# EAGLE design ogn_wind_1.4 (EAGLE 9.6.2)
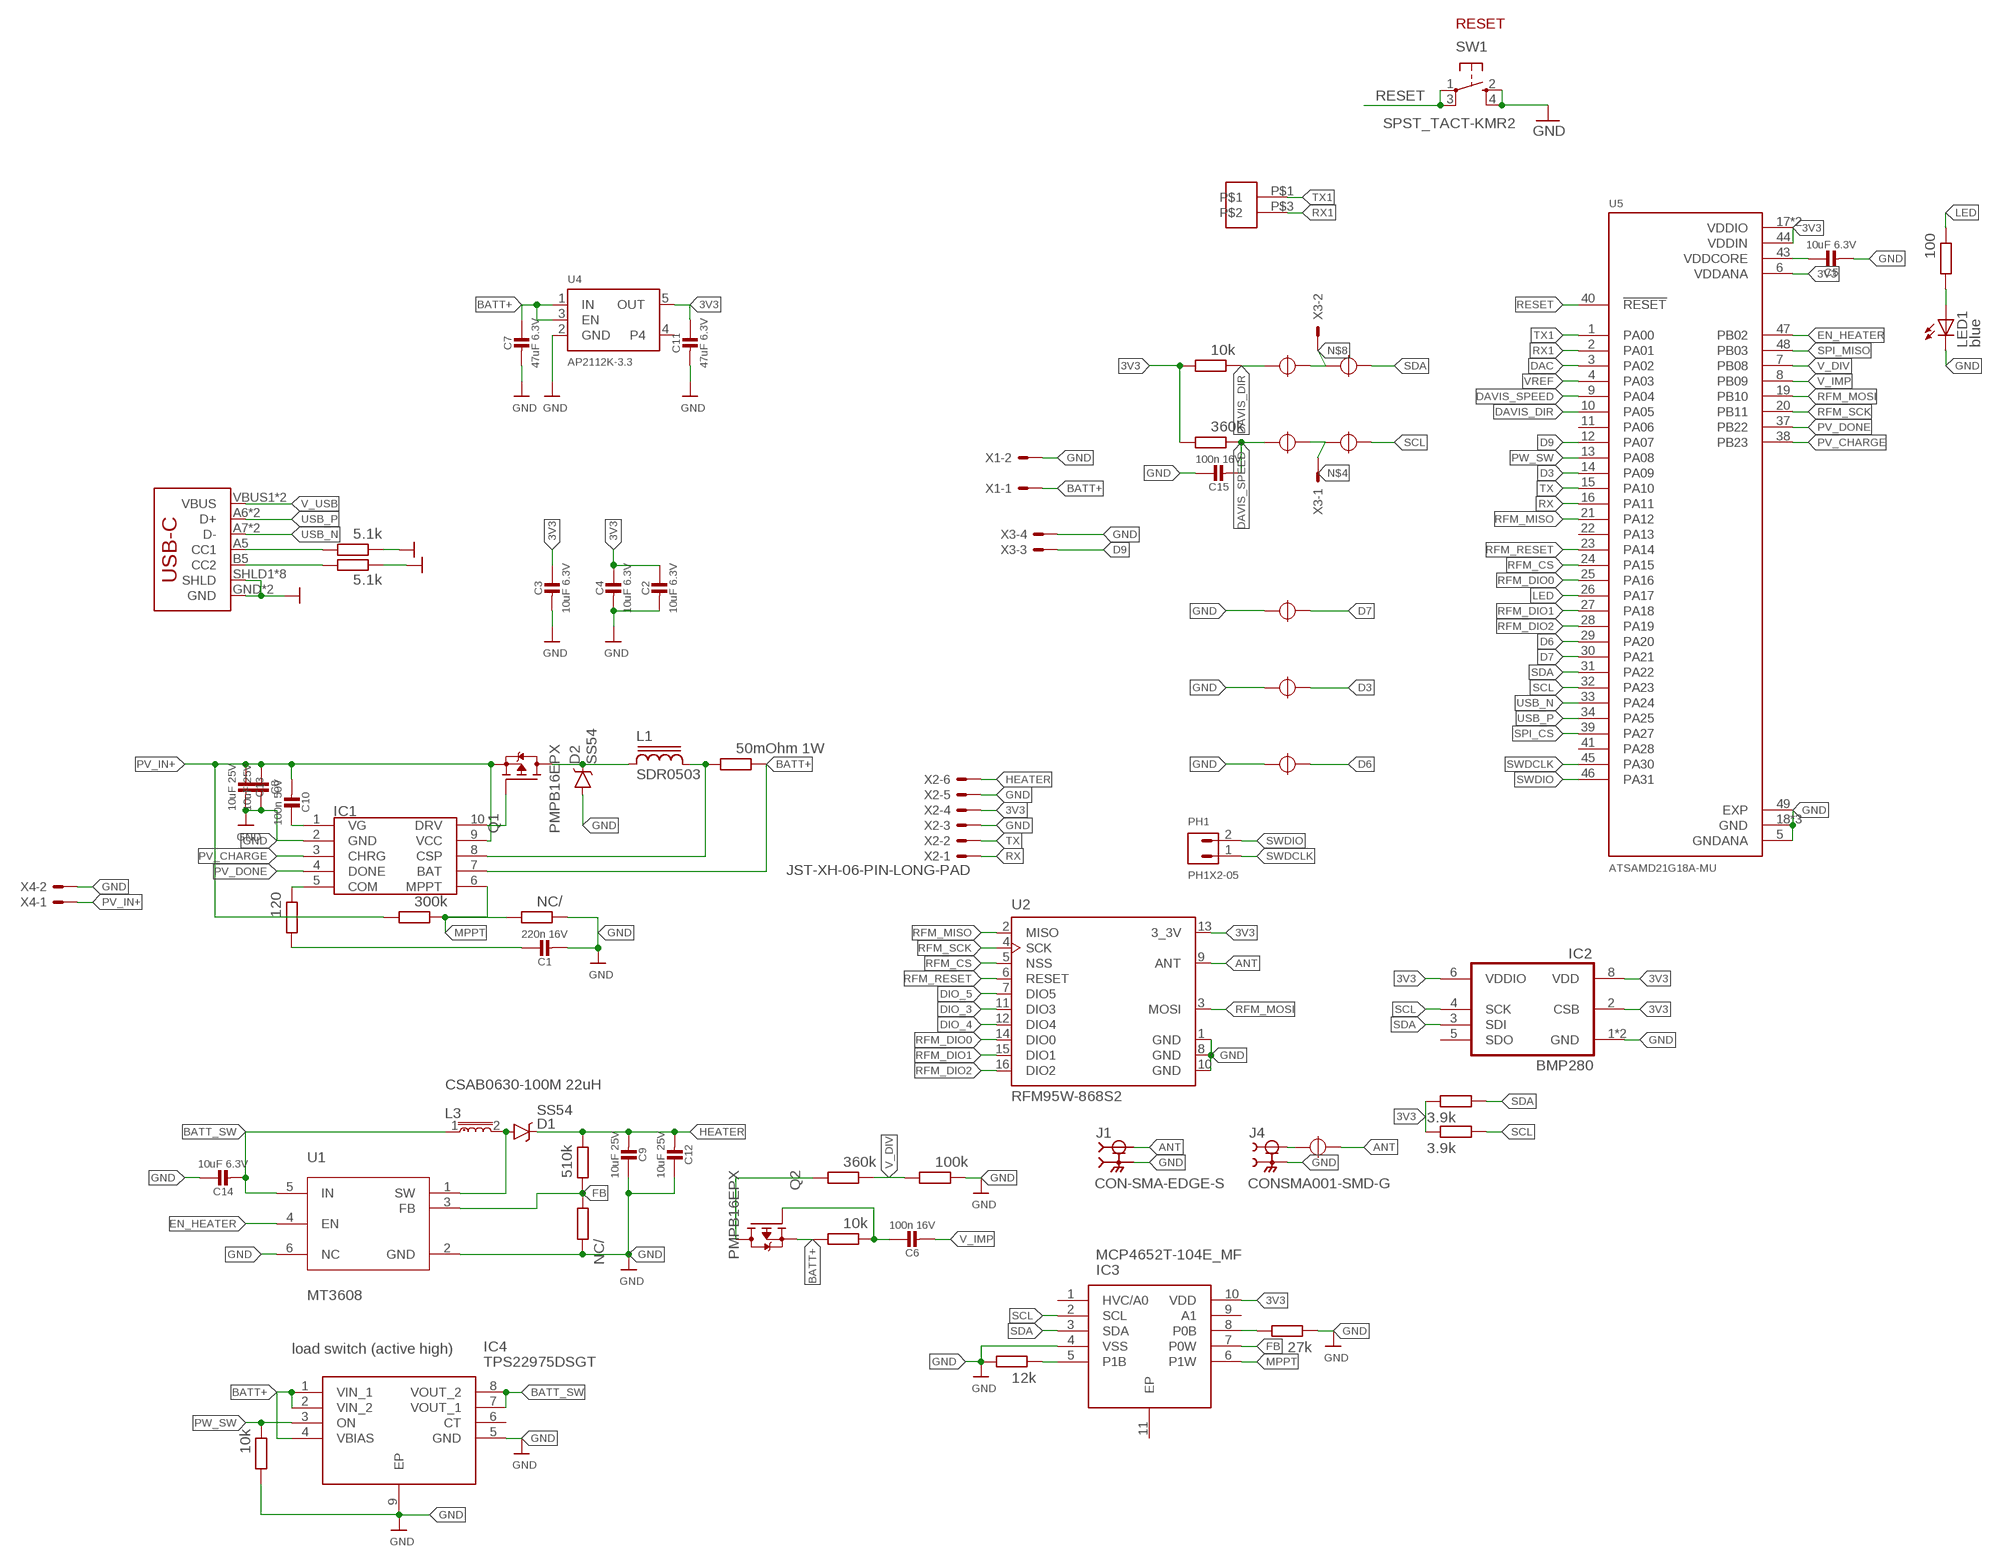
[diagram p0: schematic, sheet 1]

## Parts
C1  220n 16V  CAP_CERAMIC_0402MP  [_0402MP]
C2  10uF 6.3V  CAP_CERAMIC_0402MP  [_0402MP]
C3  10uF 6.3V  CAP_CERAMIC_0402MP  [_0402MP]
C4  10uF 6.3V  CAP_CERAMIC_0402MP  [_0402MP]
C5  10uF 6.3V  CAP_CERAMIC_0402MP  [_0402MP]
C6  100n 16V  CAP_CERAMIC_0402MP  [_0402MP]
C7  47uF 6.3V  CAP_CERAMIC0805-NOOUTLINE  [0805-NO]
C8  10uF 25V  CAP_CERAMIC_0603MP  [_0603MP]
C9  10uF 25V  CAP_CERAMIC_0603MP  [_0603MP]
C10  100n 50V  CAP_CERAMIC_0603MP  [_0603MP]
C11  47uF 6.3V  CAP_CERAMIC0805-NOOUTLINE  [0805-NO]
C12  10uF 25V  CAP_CERAMIC_0603MP  [_0603MP]
C13  10uF 25V  CAP_CERAMIC_0603MP  [_0603MP]
C14  10uF 6.3V  CAP_CERAMIC_0402MP  [_0402MP]
C15  100n 16V  CAP_CERAMIC_0402MP  [_0402MP]
D1  SS54  [DO-214AC]
D2  SS54  [DO-214AC]
IC1  CN3791  [SSOP10]
IC2  BMP280  [BMP280]
IC3  MCP4652T-104E_MF  [SON50P300X300X100-11N]
IC4  TPS22975DSGT  [SON50P200X200X80-9N]
J1  CON-SMA-EDGE-S  [RFSOLUTIONS_CON-SMA-EDGE-S]
J2  USB_C16PIN  [USB-C-16P]
J4  CONSMA001-SMD-G  [LINX_CONSMA001-SMD-G]
L1  SDR0503  [SDR0503]
L3  CSAB0630-100M 22uH  CSAB0630-100M  [INDC6060X300]
LED1  blue  LEDCHIPLED_0603  [CHIPLED_0603]
PH1  PH1X2-05  [PH005-1-2]
Q1  PMPB16EPX  [TRANS_PMPB16EPX]
Q2  PMPB16EPX  [TRANS_PMPB16EPX]
SW1  SPST_TACT-KMR2  [KMR2]
U1  MT3608  [SOT95P280X145-6N]
U2  RFM95W-868S2  [XCVR_RFM95W-868S2]
U4  AP2112K-3.3  VREG_SOT23-5  [SOT23-5]
U5  ATSAMD21G18A-MU  [QFN50P700X700X90-49N]
U$1  SJ  [SJ]
U$2  SJ  [SJ]
U$3  SJ  [SJ]
U$4  SJ  [SJ]
U$7  SJ  [SJ]
U$10  SJ  [SJ]
U$11  SJ  [SJ]
U$13  SMDPAD2  [SMDPAD2]
U$22  SJ  [SJ]
USBCR  5.1k  R-EU_R0402RF  [0402RF]
USBCR1  5.1k  R-EU_R0402RF  [0402RF]
USBCR2  360k  R-EU_R0402RF  [0402RF]
USBCR3  100k  R-EU_R0402RF  [0402RF]
USBCR4  10k  R-EU_R0402RF  [0402RF]
USBCR5  10k  R-EU_R0402RF  [0402RF]
USBCR6  300k  R-EU_R0402RF  [0402RF]
USBCR7  NC/  R-EU_R0402RF  [0402RF]
USBCR8  120  R-EU_R0402RF  [0402RF]
USBCR9  510k  R-EU_R0402RF  [0402RF]
USBCR10  NC/  R-EU_R0402RF  [0402RF]
USBCR11  10k  R-EU_R0402RF  [0402RF]
USBCR12  360k  R-EU_R0402RF  [0402RF]
USBCR13  100  R-EU_R0402RF  [0402RF]
USBCR14  3.9k  R-EU_R0402RF  [0402RF]
USBCR15  3.9k  R-EU_R0402RF  [0402RF]
USBCR17  27k  R-EU_R0402RF  [0402RF]
USBCR18  12k  R-EU_R0402RF  [0402RF]
USBCR19  50mOhm 1W  R-EU_R1206  [R1206]
X1  JST-XH-02-PIN-LONG-PAD  [JST-XH-02-PACKAGE-LONG-PAD]
X2  JST-XH-06-PIN-LONG-PAD  [JST-XH-06-PACKAGE-LONG-PAD]
X3  JST-XH-04-PIN-LONG-PAD  [JST-XH-04-PACKAGE-LONG-PAD]
X4  JST-XH-02-PIN-LONG-PAD  [JST-XH-02-PACKAGE-LONG-PAD]

## Nets
3V3: C2.1 C3.1 C4.1 C11.1 IC2.2(CSB) IC2.6(VDDIO) IC2.8(VDD) IC3.10(VDD) U2.13(3_3V) U4.5(OUT) U5.6(VDDANA) U5.17(VDDIO) U5.36(VDDIO) U5.44(VDDIN) USBCR11.1 USBCR12.1 USBCR14.2 USBCR15.2 X2.4
ANT: J1.1 U2.9(ANT) U$22.P$2
BATT+: C7.1 IC1.7(BAT) IC4.1(VIN_1) IC4.2(VIN_2) IC4.4(VBIAS) Q2.4(S) Q2.8(S) U4.1(IN) U4.3(EN) USBCR4.1 USBCR19.2 X1.1
BATT_SW: C14.2 IC4.7(VOUT_1) IC4.8(VOUT_2) L3.1 U1.5(IN)
D3: U5.14(PA09) U$10.P$2
D6: U5.29(PA20) U$11.P$2
D7: U5.30(PA21) U$7.P$2
D9: U5.12(PA07) X3.3
DAC: U5.3(PA02)
DAVIS_DIR: U5.10(PA05) U$3.P$1 USBCR11.2
DAVIS_SPEED: C15.2 U5.9(PA04) U$1.P$1 USBCR12.2
DIO_3: U2.11(DIO3)
DIO_4: U2.12(DIO4)
DIO_5: U2.7(DIO5)
EN_HEATER: U1.4(EN) U5.47(PB02)
FB: IC3.7(P0W) U1.3(FB) USBCR9.1 USBCR10.1
FB_R: IC3.8(P0B) USBCR17.1
GND: C1.2 C2.2 C3.2 C4.2 C5.2 C7.2 C8.2 C9.1 C11.2 C12.1 C13.2 C14.1 C15.1 D2.A IC1.2(GND) IC2.1(GND) IC2.7(GND) IC3.4(VSS) IC4.5(GND) IC4.9(EP) J1.G1 J1.G2 J1.G3 J1.G4 J2.GND J2.GND2(GND) J2.SHLD1(SHLD) J2.SHLD2(SHLD) J2.SHLD3(SHLD) J2.SHLD4(SHLD) J2.SHLD5(SHLD) J2.SHLD6(SHLD) J2.SHLD7(SHLD) J2.SHLD8(SHLD) J4.S1 J4.S2 LED1.C SW1.2(S) SW1.4(S1) U1.2(GND) U1.6(NC) U2.1(GND) U2.8(GND) U2.10(GND) U4.2(GND) U5.5(GNDANA) U5.18(GND) U5.35(GND) U5.42(GND) U5.49(EXP) U$7.P$1 U$10.P$1 U$11.P$1 USBCR1.2 USBCR3.2 USBCR5.1 USBCR7.2 USBCR10.2 USBCR17.2 USBCR18.1 USBCR.2 X1.2 X2.3 X2.5 X3.4 X4.2
HEATER: C9.2 C12.2 D1.C USBCR9.2 X2.6
LED: U5.26(PA17) USBCR13.2
MPPT: IC1.6(MPPT) IC3.6(P1W) USBCR6.2 USBCR7.1
MPPT_R: IC3.5(P1B) USBCR18.2
N$1: IC1.10(DRV) Q1.3(G)
N$2: D2.C L1.1 Q1.1(D) Q1.2(D) Q1.5(D) Q1.6(D) Q1.7(D)
N$3: IC1.8(CSP) L1.2 USBCR19.1
N$4: U$1.P$2 U$2.P$1 X3.1
N$5: LED1.A USBCR13.1
N$6: Q2.1(D) Q2.2(D) Q2.5(D) Q2.6(D) Q2.7(D) USBCR2.1
N$7: C10.1 IC1.1(VG)
N$8: U$3.P$2 U$4.P$1 X3.2
N$9: J4.1 U$22.P$1
N$10: C1.1 USBCR8.1
N$11: IC1.5(COM) USBCR8.2
N$12: C6.1 Q2.3(G) USBCR4.2
N$17: J2.A5(CC1) USBCR.1
N$18: J2.B5(CC2) USBCR1.1
PV_CHARGE: IC1.3(CHRG) U5.38(PB23)
PV_DONE: IC1.4(DONE) U5.37(PB22)
PV_IN+: C8.1 C10.2 C13.1 IC1.9(VCC) Q1.4(S) Q1.8(S) USBCR6.1 X4.1
PW_SW: IC4.3(ON) U5.13(PA08) USBCR5.2
RESET: SW1.1(P) SW1.3(P1) U5.40(!RESET)
RFM_CS: U2.5(NSS) U5.24(PA15)
RFM_DIO0: U2.14(DIO0) U5.25(PA16)
RFM_DIO1: U2.15(DIO1) U5.27(PA18)
RFM_DIO2: U2.16(DIO2) U5.28(PA19)
RFM_MISO: U2.2(MISO) U5.21(PA12)
RFM_MOSI: U2.3(MOSI) U5.19(PB10)
RFM_RESET: U2.6(RESET) U5.23(PA14)
RFM_SCK: U2.4(SCK) U5.20(PB11)
RX: U5.16(PA11) X2.1
RX1: U5.2(PA01) U$13.P$3
SCL: IC2.4(SCK) IC3.2(SCL) U5.32(PA23) U$2.P$2 USBCR15.1
SDA: IC2.3(SDI) IC3.3(SDA) U5.31(PA22) U$4.P$2 USBCR14.1
SPI_CS: U5.39(PA27)
SPI_MISO: U5.48(PB03)
SW: D1.A L3.2 U1.1(SW)
SWDCLK: PH1.1 U5.45(PA30)
SWDIO: PH1.2 U5.46(PA31)
TX: U5.15(PA10) X2.2
TX1: U5.1(PA00) U$13.P$1
USB_N: J2.A7(D-) J2.B7(D-) U5.33(PA24)
USB_P: J2.A6(D+) J2.B6(D+) U5.34(PA25)
V_DIV: U5.7(PB08) USBCR2.2 USBCR3.1
V_IMP: C6.2 U5.8(PB09)
V_USB: J2.VBUS1(VBUS) J2.VBUS2(VBUS)
VDDCORE: C5.1 U5.43(VDDCORE)
VREF: U5.4(PA03)
Unconnected: IC2.5(SDO) IC3.1(HVC/A0) IC3.9(A1) IC3.11(EP) IC4.6(CT) U4.4 U5.11(PA06) U5.22(PA13) U5.41(PA28)

## Notes on the sheet
- RESET
- load switch (active high)

## Library data of the parts
C1-C5 C7-C14 = microbuilder:CAP_CERAMIC: Ceramic Capacitors For new designs, use the packages preceded by an '_' character since they are more reliable: The following footprints should be used on most boards: _0402 - Standard footprint for regular board layouts _0603 - Standard footprint for regular board layouts _0805 - Standard footprint for regular board layouts _1206 - Standard footprint for regular board layouts For extremely tight-pitch boards where space is at a premium, the following 'micro-pitch' footprints can be used (smaller pads, no silkscreen outline, etc.): _0402MP - Micro-pitch footprint for very dense/compact boards _0603MP - Micro-pitch footprint for very dense/compact boards _0805MP - Micro-pitch footprint for very dense/compact boards _1206MP - Micro-pitch footprint for very dense/compact boards
C6 C15 = microbuilder:CAP_CERAMIC: Ceramic Capacitors For new designs, use the packages preceded by an '_' character since they are more reliable: The following footprints should be used on most boards: _0402 - Standard footprint for regular board layouts _0603 - Standard footprint for regular board layouts _0805 - Standard footprint for regular board layouts _1206 - Standard footprint for regular board layouts For extremely tight-pitch boards where space is at a premium, the following 'micro-pitch' footprints can be used (smaller pads, no silkscreen outline, etc.): _0402MP - Micro-pitch footprint for very dense/compact boards _0603MP - Micro-pitch footprint for very dense/compact boards _0805MP - Micro-pitch footprint for very dense/compact boards _1206MP - Micro-pitch footprint for very dense/compact boards; SPICEPREFIX: C
D1 D2 = SS54:SS54: SCHOTTKY DIODES 40Vpeak, 28Vrms 5A (SBD) SMA(DO-214AC) Check availability <https://pricing.snapeda.com/parts/SS54/MDD/view-part?ref=eda>; AVAILABILITY: In Stock; DESCRIPTION: Diode Schottky 40 V 5A Surface Mount SMA; MF: MDD; MP: SS54; PACKAGE: None; PRICE: None; PURCHASE-URL: https://pricing.snapeda.com/search?q=SS54&ref=eda
IC1 = CN3791:CN3791: Solar Battery IC. LCSC C154992 Check availability <https://pricing.snapeda.com/parts/CN3791/Consonance/view-part?ref=eda>; AVAILABILITY: Not in stock; DESCRIPTION: 4A, Standalone Li-ion Battery Charger IC With Photovoltaic Cell MPPT Function; MF: Consonance; MP: CN3791; PACKAGE: Package; PRICE: None
IC2 = bosch-bmp280:BMP280: The BMP280 is an absolute barometric pressure sensor especially designed for mobile applications. The sensor module is housed in an extremely compact 8-pin metal-lid LGA package with a footprint of only 2.0 × 2.5 mm2 and 0.95 mm package height. Its small dimensions and its low power consumption of 2.7 μA @1Hz allow the implementation in battery driven devices such as mobile phones, GPS modules or watches. The library has been designed by Richard Magdycz <https://www.facebook.com/groups/eaglecadsoftUK>
IC3 = SamacSys_Parts:MCP4652T-104E_MF: Digital Potentiometer ICs Sngl 8B V I2C Rheo Source: Datasheet <https://componentsearchengine.com//MCP4652T-104E_MF.pdf>; DESCRIPTION: Digital Potentiometer ICs Sngl 8B V I2C Rheo; HEIGHT: 1mm; MANUFACTURER_NAME: Microchip; MANUFACTURER_PART_NUMBER: MCP4652T-104E/MF; MOUSER2_PART_NUMBER: 579-MCP4652T-104E/MF; MOUSER2_PRICE-STOCK: https://www.mouser.com/Search/Refine.aspx?Keyword=579-MCP4652T-104E%2FMF
IC4 = TPS22975DSGT:TPS22975DSGT: 5.7V, 6A, 16m load switch with adjustable rise time & optional QOD Source: Datasheet <http://www.ti.com/lit/gpn/TPS22975> Check availability <https://pricing.snapeda.com/parts/TPS22975DSGT/Texas%20Instruments/view-part?ref=eda>; AVAILABILITY: In Stock; CHECK_PRICES: https://www.snapeda.com/parts/TPS22975DSGT/Texas+Instruments/view-part/?ref=eda; DESCRIPTION: 5.7-V, 6-A, 16-mΩ load switch with adj. rise time, optional output discharge, and thermal shutdown; JLCPCB: C524777; MF: Texas Instruments; MP: TPS22975DSGT; PACKAGE: WSON-8 Texas Instruments; PRICE: None; PURCHASE-URL: https://www.snapeda.com/api/url_track_click_mouser/?unipart_id=1158163&manufacturer=Texas Instruments&part_name=TPS22975DSGT&search_term=tps22975; SNAPEDA_LINK: https://www.snapeda.com/parts/TPS22975DSGT/Texas+Instruments/view-part/?ref=snap
J1 = CON-SMA-EDGE-S:CON-SMA-EDGE-S: Check availability <https://pricing.snapeda.com/parts/CON-SMA-EDGE-S/RF%20Solutions/view-part?ref=eda>; AVAILABILITY: In Stock; DESCRIPTION: SMA Connector Jack, Female Socket - Board Edge, End Launch Solder; MF: RF Solutions; MP: CON-SMA-EDGE-S; PACKAGE: None; PRICE: None; PURCHASE-URL: https://pricing.snapeda.com/search?q=CON-SMA-EDGE-S&ref=eda
J2 = SparkFun-Connectors:USB_C: USB Type C 16Pin Connector Super Speed pins not available on the 16-pin purely SMD connector so this part is best for USB 2.0 implementations. D1 and D2 are tied together enabling D+/- no matter which way the cable is plugged into the connector. The two channel configuration pins (CC1/2) are exposed. These are normally connected to ground via 5.1k resistors but can be reconfigured for high current/high power applications.; PROD_ID: CONN-14122
J4 = CONSMA001-SMD-G:CONSMA001-SMD-G: Check availability <https://pricing.snapeda.com/parts/CONSMA001-SMD-G/Linx%20Technologies/view-part?ref=eda> Check availability <https://pricing.snapeda.com/parts/CONSMA001-SMD-G/Linx%20Technologies/view-part?ref=eda> Check availability <https://pricing.snapeda.com/parts/CONSMA001-SMD-G/TE%20Connectivity/view-part?ref=eda>; AVAILABILITY: In Stock; CHECK_PRICES: https://www.snapeda.com/parts/CONSMA001-SMD-G/TE+Connectivity/view-part/?ref=eda; DESCRIPTION: SMA Jack 50 Ohm PCB Surface Mount; MF: TE Connectivity; MP: CONSMA001-SMD-G; PACKAGE: None; PRICE: None; PURCHASE-URL: https://www.snapeda.com/api/url_track_click_mouser/?unipart_id=13698885&manufacturer=TE Connectivity&part_name=CONSMA001-SMD-G&search_term=consma001-smd-g; SNAPEDA_LINK: https://www.snapeda.com/parts/CONSMA001-SMD-G/TE+Connectivity/view-part/?ref=snap
L1 = inductor-bourns:SDR0503: POWER INDUCTOR
L3 = CSAB0630-100M:CSAB0630-100M: SMD Inductor 10uH-20%-5A Check availability <https://pricing.snapeda.com/parts/CSAB0630-100M/Codaca/view-part?ref=eda>; AVAILABILITY: Not in stock; DESCRIPTION: SMD Inductor 10uH-20%-5A; MF: Codaca; MP: CSAB0630-100M; PACKAGE: None; PRICE: None
LED1 = led:LED: LED OSRAM: - CHIPLED LG R971, LG N971, LY N971, LG Q971, LY Q971, LO R971, LY R971 LH N974, LH R974 LS Q976, LO Q976, LY Q976 LO Q996 - Hyper CHIPLED LW Q18S LB Q993, LB Q99A, LB R99A - SideLED LS A670, LO A670, LY A670, LG A670, LP A670 LB A673, LV A673, LT A673, LW A673 LH A674 LY A675 LS A676, LA A676, LO A676, LY A676, LW A676 LS A679, LY A679, LG A679 - Hyper Micro SIDELED® LS Y876, LA Y876, LO Y876, LY Y876 LT Y87S - SmartLED LW L88C, LW L88S LB L89C, LB L89S, LG L890 LS L89K, LO L89K, LY L89K LS L896, LA L896, LO L896, LY L896 - TOPLED LS T670, LO T670, LY T670, LG T670, LP T670 LSG T670, LSP T670, LSY T670, LOP T670, LYG T670 LG T671, LOG T671, LSG T671 LB T673, LV T673, LT T673, LW T673 LH T674 LS T676, LA T676, LO T676, LY T676, LB T676, LH T676, LSB T676, LW T676 LB T67C, LV T67C, LT T67C, LS T67K, LO T67K, LY T67K, LW E67C LS E67B, LA E67B, LO E67B, LY E67B, LB E67C, LV E67C, LT E67C LW T67C LS T679, LY T679, LG T679 LS T770, LO T770, LY T770, LG T770, LP T770 LB T773, LV T773, LT T773, LW T773 LH T774 LS E675, LA E675, LY E675, LS T675 LS T776, LA T776, LO T776, LY T776, LB T776 LHGB T686 LT T68C, LB T68C - Hyper Mini TOPLED® LB M676 - Mini TOPLED Santana® LG M470 LS M47K, LO M47K, LY M47K Source: http://www.osram.convergy.de LUXEON: - LUMILED® LXK2-PW12-R00, LXK2-PW12-S00, LXK2-PW14-U00, LXK2-PW14-V00 LXK2-PM12-R00, LXK2-PM12-S00, LXK2-PM14-U00 LXK2-PE12-Q00, LXK2-PE12-R00, LXK2-PE12-S00, LXK2-PE14-T00, LXK2-PE14-U00 LXK2-PB12-K00, LXK2-PB12-L00, LXK2-PB12-M00, LXK2-PB14-N00, LXK2-PB14-P00, LXK2-PB14-Q00 LXK2-PR12-L00, LXK2-PR12-M00, LXK2-PR14-Q00, LXK2-PR14-R00 LXK2-PD12-Q00, LXK2-PD12-R00, LXK2-PD12-S00 LXK2-PH12-R00, LXK2-PH12-S00 LXK2-PL12-P00, LXK2-PL12-Q00, LXK2-PL12-R00 Source: www.luxeon.com KINGBRIGHT: KA-3528ASYC Source: www.kingbright.com
PH1 = pinheader_small:PH1X2
Q1 = PMPB16EPX:PMPB16EPX: P-Channel 30V 7.5A (Ta) 2W (Ta), 12.5W (Tc) Surface Mount DFN2020MD-6 Check availability <https://pricing.snapeda.com/parts/PMPB16EPX/Nexperia%20USA%20Inc./view-part?ref=eda>; AVAILABILITY: In Stock; CHECK_PRICES: https://www.snapeda.com/parts/PMPB16EPX/Nexperia/view-part/?ref=eda; DESCRIPTION: P-Channel 30 V 7.5A (Ta) 2W (Ta), 12.5W (Tc) Surface Mount DFN2020MD-6; JLCPCB: C919545; MF: Nexperia USA Inc.; MP: PMPB16EPX; PACKAGE: DFN2020MD?6-6 Nexperia USA Inc.; PRICE: None; PURCHASE-URL: https://www.snapeda.com/api/url_track_click_mouser/?unipart_id=4503203&manufacturer=Nexperia USA Inc.&part_name=PMPB16EPX&search_term=dfn2020m; SNAPEDA_LINK: https://www.snapeda.com/parts/PMPB16EPX/Nexperia/view-part/?ref=snap; SPICEPREFIX: Q
Q2 = PMPB16EPX:PMPB16EPX: P-Channel 30V 7.5A (Ta) 2W (Ta), 12.5W (Tc) Surface Mount DFN2020MD-6 Check availability <https://pricing.snapeda.com/parts/PMPB16EPX/Nexperia%20USA%20Inc./view-part?ref=eda>; AVAILABILITY: In Stock; CHECK_PRICES: https://www.snapeda.com/parts/PMPB16EPX/Nexperia/view-part/?ref=eda; DESCRIPTION: P-Channel 30 V 7.5A (Ta) 2W (Ta), 12.5W (Tc) Surface Mount DFN2020MD-6; JLCPCB: C919545; MF: Nexperia USA Inc.; MP: PMPB16EPX; PACKAGE: DFN2020MD?6-6 Nexperia USA Inc.; PRICE: None; PURCHASE-URL: https://www.snapeda.com/api/url_track_click_mouser/?unipart_id=4503203&manufacturer=Nexperia USA Inc.&part_name=PMPB16EPX&search_term=dfn2020m; SNAPEDA_LINK: https://www.snapeda.com/parts/PMPB16EPX/Nexperia/view-part/?ref=snap
SW1 = adafruit:SPST_TACT: SMT 6mm switch, EVQQ2 series http://www.ladyada.net/library/eagle
U1 = MT3608:MT3608: High Efficiency 1.2MHz 2A Step Up Converter Check availability <https://pricing.snapeda.com/parts/MT3608/Aerosemi%20Technology%20Co.%2C%20Ltd/view-part?ref=eda>; AVAILABILITY: Not in stock; DESCRIPTION: High Efficiency 1.2MHz 2A Step Up Converter; MF: Aerosemi Technology Co., Ltd; MP: MT3608; PACKAGE: Package; PRICE: None
U2 = RFM95W-868S2:RFM95W-868S2: Mod Txrx Lora +20dbm 868mhz Smd Check availability <https://pricing.snapeda.com/parts/RFM95W-868S2/RF/view-part?ref=eda>; AVAILABILITY: In Stock; DESCRIPTION: General ISM < 1GHz LoRa™ Transceiver Module 868MHz Antenna Not Included Surface Mount; MF: RF; MP: RFM95W-868S2; PACKAGE: Non Standard RF Solutions; PRICE: None; PURCHASE-URL: https://pricing.snapeda.com/search?q=RFM95W-868S2&ref=eda
U4 = microbuilder:VREG_SOT23-5: SOT23-5 Fixed Voltage Regulators Part Current Out V Out V In V Dropout θJA (°C/W) TJ (°C) Digikey Part No. ADP121 150mA 3.3V 3.4-5.5V 0.09V @ 150mA -- -- ADP121-AUJZ33R7CT-ND ADP121 150mA 3.0V 3.1-5.5V 0.09V @ 150mA -- -- ADP121-AUJZ30R7CT-ND ADP122 300mA 3.3V 3.4-5.5V 0.085V @ 300mA -- -- ADP122AUJZ-3.3-R7CT-ND ADP1712 300mA 3.3V 3.5-5.5V 0.17V @ 300mA -- -- ADP1712AUJZ-3.3-R7TR-ND AP7311 (Low Cost) 150mA 3.3V 3.5-6V 0.15V @ 150mA -- -- AP7311-33WG-7DICT-ND LD39015M18R 150mA 1.8V 1.9V-5.5V 0.08V @ 100mA -- -- 497-6977-1-ND LP2985A-33DBVR 150mA 3.3V 3.3-16V 0.28V @ 150mA 206 150 296-18479-1-ND MCP1824T-3302E/OT 300mA 3.3V 3.5V-6V 0.2V @ 300mA -- -- MCP1824T-3302E/OTCT-ND MIC5205-2.5YM5 TR 150mA 2.5V 2.7-16V 0.165V @ 150mA -- -- 576-1257-2-ND MIC5205-3.0YM5 TR 150mA 3.0V 3.2V-16V 0.165V @ 150mA -- -- 576-1258-2-ND MIC5205-3.3YM5 TR 150mA 3.3V 3.5V-16V 0.165V @ 150mA -- -- 576-1259-2-ND TPS780330220 150mA 3.3V+2.2V 3.6-5.5V 250mV Max -- -- 296-23332-1-ND TDA3663/N1,135 100mA 3.3V 3.5-45V 0.18V @ 50mA -- -- 568-5343-1-ND Max operating temp can be calculated using θJA, TJ (max junction temperature), and power in watts. Set the "Maximum Ambient Temperature" until it reaches TJ ("Max Junction Temperature"), which is the absolute limit for safe use of the regulator: Heat Sink Temperature Calculator <http://www.daycounter.com/Calculators/Heat-Sink-Temperature-Calculator.phtml> For example, With 12V source into a 3.3V LP2985 and a 30mA load, we are dissipating (12V-3.3V) * 0.03A = 0.261W. With a θJA of 206 °C/W, a TJ of 150°C, and 261mW we can safely use the chip without a heat sink up to 75°C (=147.1°C Junction Temperature).
U5 = ATSAMD21G18A-MU:ATSAMD21G18A-MU: Cortex-M0+, 256KB FLASH, 32KB SRAM, USB, DMA, T&R - 48QFN IND TEMP, GREEN, 1.6-3.6V, 48MHz/ QFN (ZA) Check availability <https://pricing.snapeda.com/parts/ATSAMD21G18A-MU/Microchip/view-part?ref=eda>; AVAILABILITY: In Stock; DESCRIPTION: ARM® Cortex®-M0+ SAM D21G, Functional Safety (FuSa) Microcontroller IC 32-Bit Single-Core 48MHz 256KB (256K x 8) FLASH 48-QFN (7x7); MF: Microchip; MP: ATSAMD21G18A-MU; PACKAGE: QFN-48 Microchip; PRICE: None; PURCHASE-URL: https://pricing.snapeda.com/search?q=ATSAMD21G18A-MU&ref=eda
U$1-U$4 U$7 U$10 U$11 U$22 = 000_eigene_Bauteile:SJ
U$13 = 000_eigene_Bauteile:SMDPAD2
USBCR USBCR1 USBCR5-USBCR15 USBCR17-USBCR19 = rcl:R-EU_: RESISTOR, European symbol
USBCR2-USBCR4 = rcl:R-EU_: RESISTOR, European symbol; SPICEPREFIX: B
X1 X4 = Rembrandt Electronics - JST XH Connectors v1-0:JST-XH-02-PIN: JST XH Connector 2 Pin Wire to board connector. Pitch: 2,54 mm, (0.100") Number of pins: 2 Created by Rembrandt Electronics www.rembrandtelectronics.com
X2 = Rembrandt Electronics - JST XH Connectors v1-0:JST-XH-06-PIN: JST XH Connector 2 Pin Wire to board connector. Pitch: 2,54 mm, (0.100") Number of pins: 6 Created by Rembrandt Electronics www.rembrandtelectronics.com
X3 = Rembrandt Electronics - JST XH Connectors v1-0:JST-XH-04-PIN: JST XH Connector 2 Pin Wire to board connector. Pitch: 2,54 mm, (0.100") Number of pins: 4 Created by Rembrandt Electronics www.rembrandtelectronics.com

## Board
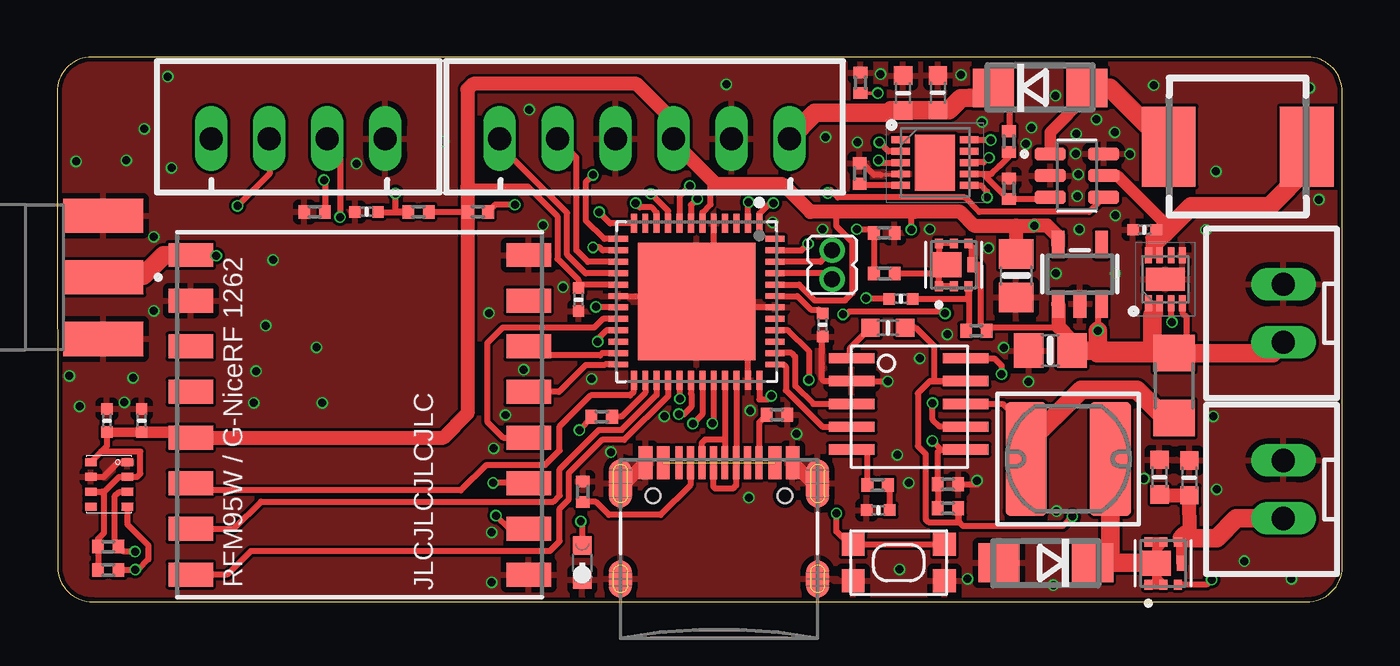
[diagram p1: board, top side]
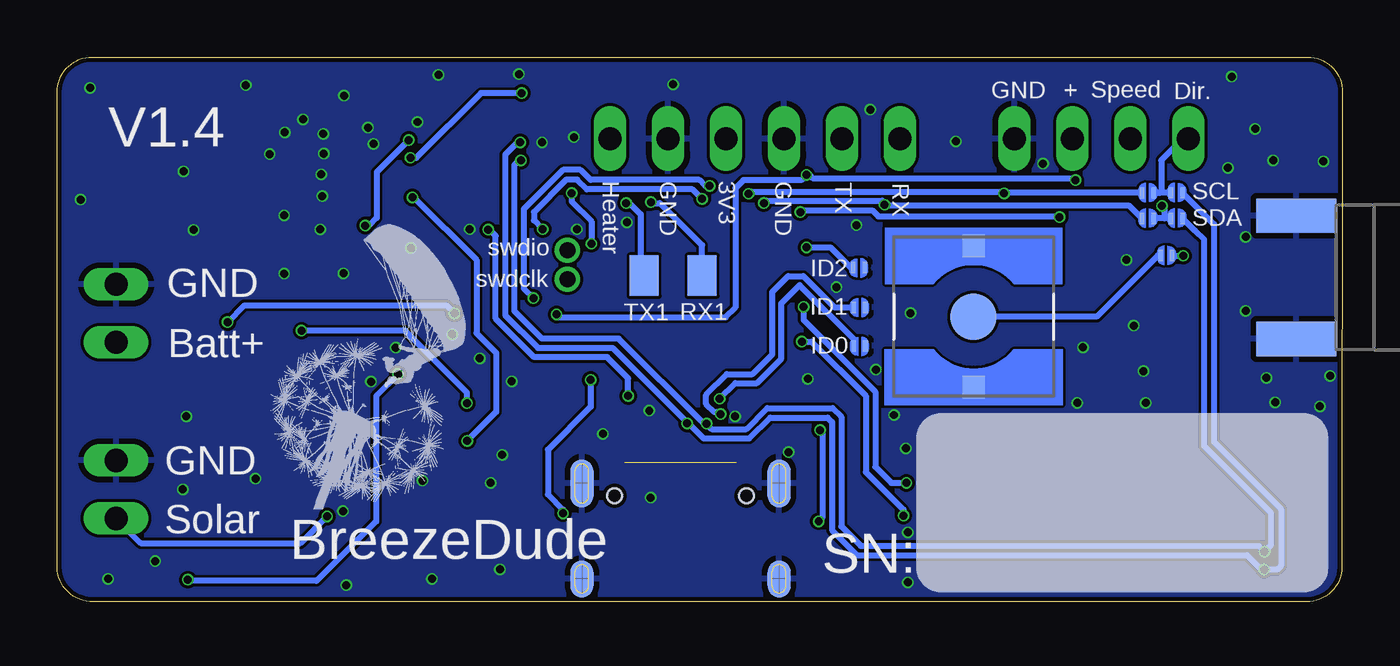
[diagram p2: board, bottom side, seen from below]

Size 56.34 x 23.86 mm. Coordinates in mm from the lower left corner, seen from the top.
Outline: 56.34,1.52 56.33,22.34 arc90 54.8,23.86 1.52,23.86 arc90 0,22.34 0.02,1.52 arc90 1.58,0 54.75,0 arc90 56.34,1.52
Copper layers (1*16): Top 0.035mm / dielectric 1.6mm / Bottom 0.035mm
Design rules "jlcpcb-2layers *": minimum track width 5mil, minimum drill 0.3mm, track to track 5mil, track to pad 5mil, pad to pad 5mil, via to via 5mil, smd to smd 5mil, copper to edge 0.2mm, drill to drill 6mil, minimum pad ring 8mil, minimum via ring 3mil, stop-mask expansion 4mil, vias tented up to drill 20mil, thermal gap 10mil

### Footprints (pad centres in the part's own frame; a part is rotated, then mirrored left to right if it is on the bottom)
_0402MP = smd 0.5 x 0.5: 1 -0.508,0; 2 0.508,0
0805-NO = smd 1.3 x 1.5: 1 -0.95,0; 2 0.95,0
_0603MP = smd 0.8 x 0.8: 1 -0.762,0; 2 0.762,0
DO-214AC = smd 1.8 x 1.7: A 2.05,0; C -2.05,0
SSOP10 = smd 2 x 0.45: 1 0,2; 2 0,1; 3 0,0; 4 0,-1; 5 0,-2; 6 5,-2; 7 5,-1; 8 5,0; 9 5,1; 10 5,2
BMP280 = smd 0.35 x 0.5: 1 0.975,-0.8; 2 0.325,-0.8; 3 -0.325,-0.8; 4 -0.975,-0.8; 5 -0.975,0.8; 6 -0.325,0.8; 7 0.325,0.8; 8 0.975,0.8
SON50P300X300X100-11N = smd 0.8 x 0.3: 1 -1.5,1; 2 -1.5,0.5; 3 -1.5,0; 4 -1.5,-0.5; 5 -1.5,-1; 6 1.5,-1; 7 1.5,-0.5; 8 1.5,0; 9 1.5,0.5; 10 1.5,1 | smd 1.75 x 2.45: 11 0,0
SON50P200X200X80-9N = smd 0.7 x 0.3: 1 -1.05,0.75; 2 -1.05,0.25; 3 -1.05,-0.25; 4 -1.05,-0.75; 5 1.05,-0.75; 6 1.05,-0.25; 7 1.05,0.25; 8 1.05,0.75 | smd 1 x 1.7: 9 0,0
RFSOLUTIONS_CON-SMA-EDGE-S = smd 3.5 x 1.5: 1 0,0; G1 0,2.7; G2 0,-2.7 | smd 3.5 x 1.5 bottom: G3 0,2.7; G4 0,-2.7
USB-C-16P = smd 0.3 x 1.45: A5 -1.25,0; A6 -0.25,0; A7 0.25,0; A8 1.25,0; B5 1.75,0; B6 0.75,0; B7 -0.75,0; B8 -1.75,0 | smd 0.6 x 1.45: GND -3.225,0; GND2 3.225,0 | smd 1 x 2.1: SHLD1 -4.32,-0.915; SHLD2 4.32,-0.915 | smd 1 x 2.1 bottom: SHLD3 -4.32,-0.915; SHLD4 4.32,-0.915 | smd 1 x 1.6: SHLD5 -4.32,-5.095; SHLD8 4.32,-5.095 | smd 1 x 1.6 bottom: SHLD6 -4.32,-5.095; SHLD7 4.32,-5.095 | smd 0.55 x 1.45: VBUS1 -2.45,0; VBUS2 2.45,0 | hole 0.65: -2.89,-1.445; 2.89,-1.445
LINX_CONSMA001-SMD-G = smd 2.05 x 2.05: 1 0,0 | smd 1 x 1: S1 -3.1,0; S2 3.1,0
SDR0503 = smd 5 x 1.8: 1 0,1.85; 2 0,-1.85
INDC6060X300 = smd 2.35 x 3.5: 1 -3.025,0; 2 3.025,0
CHIPLED_0603 = smd 0.8 x 0.8: A 0,-0.75; C 0,0.75
PH005-1-2 = drill 0.7 pad 1.016: 1 0,0; 2 1.27,0
TRANS_PMPB16EPX = smd 0.43 x 0.35: 1 -0.935,0.65; 2 -0.935,0; 3 -0.935,-0.65; 4 0.935,-0.65; 5 0.935,0; 6 0.935,0.65 | smd 1.1 x 1.25: 7 0,0.285 | smd 0.66 x 0.35: 8 0,-0.775
KMR2 = smd 1 x 1: 1 2,0.8; 2 2,-0.8; 3 -2,0.8; 4 -2,-0.8
SOT95P280X145-6N = smd 1.37 x 0.59: 1 -1.17,0.95; 2 -1.17,0; 3 -1.17,-0.95; 4 1.17,-0.95; 5 1.17,0; 6 1.17,0.95
XCVR_RFM95W-868S2 = smd 1.95 x 1.05: 1 -7.4,7; 2 -7.4,5; 3 -7.4,3; 4 -7.4,1; 5 -7.4,-1; 6 -7.4,-3; 7 -7.4,-5; 8 -7.4,-7; 9 7.4,-7; 10 7.4,-5; 11 7.4,-3; 12 7.4,-1; 13 7.4,1; 14 7.4,3; 15 7.4,5; 16 7.4,7
SOT23-5 = smd 0.55 x 1.2: 1 -0.95,-1.3; 2 0,-1.3; 3 0.95,-1.3; 4 0.95,1.3; 5 -0.95,1.3
QFN50P700X700X90-49N = smd 0.84 x 0.26: 1 -3.435,2.75; 2 -3.435,2.25; 3 -3.435,1.75; 4 -3.435,1.25; 5 -3.435,0.75; 6 -3.435,0.25; 7 -3.435,-0.25; 8 -3.435,-0.75; 9 -3.435,-1.25; 10 -3.435,-1.75; 11 -3.435,-2.25; 12 -3.435,-2.75; 25 3.435,-2.75; 26 3.435,-2.25; 27 3.435,-1.75; 28 3.435,-1.25; 29 3.435,-0.75; 30 3.435,-0.25; 31 3.435,0.25; 32 3.435,0.75; 33 3.435,1.25; 34 3.435,1.75; 35 3.435,2.25; 36 3.435,2.75 | smd 0.26 x 0.84: 13 -2.75,-3.435; 14 -2.25,-3.435; 15 -1.75,-3.435; 16 -1.25,-3.435; 17 -0.75,-3.435; 18 -0.25,-3.435; 19 0.25,-3.435; 20 0.75,-3.435; 21 1.25,-3.435; 22 1.75,-3.435; 23 2.25,-3.435; 24 2.75,-3.435; 37 2.75,3.435; 38 2.25,3.435; 39 1.75,3.435; 40 1.25,3.435; 41 0.75,3.435; 42 0.25,3.435; 43 -0.25,3.435; 44 -0.75,3.435; 45 -1.25,3.435; 46 -1.75,3.435; 47 -2.25,3.435; 48 -2.75,3.435 | smd 5.15 x 5.15: 49 0,0
SJ = smd 0.2 x 0.5: P$1 -0.254,-0.013; P$2 0.254,-0.013
SMDPAD2 = smd 1.27 x 1.778: P$1 0,0; P$3 -2.54,0
0402RF = smd 0.51 x 0.6: 1 -0.45,0; 2 0.45,0
R1206 = smd 1.6 x 1.803: 1 -1.422,0; 2 1.422,0
JST-XH-02-PACKAGE-LONG-PAD = drill 1.016 long: 1 -1.27,0; 2 1.27,0
JST-XH-06-PACKAGE-LONG-PAD = drill 1.016 long: 1 -6.35,0; 2 -3.81,0; 3 -1.27,0; 4 1.27,0; 5 3.81,0; 6 6.35,0
JST-XH-04-PACKAGE-LONG-PAD = drill 1.016 long: 1 -3.81,0; 2 -1.27,0; 3 1.27,0; 4 3.81,0

### Placement (x,y rotation side)
C1  35.99,4.01 180 top
C2  2.19,7.94 90 top
C3  22.86,13.24 270 top
C4  3.71,7.94 90 top
C5  33.56,12.13 270 top
C6  36.98,13.27 180 top
C7  43.53,11.01 180 top
C8  49.62,5.43 90 top
C9  38.6,22.3 270 top
C10  36.41,12 0 top
C11  42.03,14.28 270 top
C12  37.08,22.29 270 top
C13  48.32,5.46 90 top
C14  47.66,16.3 0 top
C15  13.56,17.08 0 top
D1  43.08,22.51 0 top
D2  43.33,1.71 180 top
IC1  34.83,8.67 0 top
IC2  2.28,5.14 90 top
IC3  38.48,19.24 0 top
IC4  48.57,14.13 90 top
J1  2.03,14.21 0 top
J2  29.02,6.1 0 top
J4  16.17,12.49 270 bottom
L1  44.32,6.25 270 top
L3  51.75,19.94 180 top
LED1  23.01,1.71 180 top
PH1  33.97,14.13 90 top
Q1  48.48,1.68 90 top
Q2  39.3,14.76 90 top
SW1  36.89,1.71 0 top
U1  44.7,18.67 0 top
U2  13.27,8.19 180 top
U4  44.83,14.35 0 top
U5  28.03,13.14 270 top
U$1  8.54,17.92 0 bottom
U$2  7.27,17.93 0 bottom
U$3  8.54,16.8 0 bottom
U$4  7.27,16.81 0 bottom
U$7  21.16,12.89 180 bottom
U$10  21.19,14.63 180 bottom
U$11  21.16,11.19 180 bottom
U$13  30.6,14.29 180 bottom
U$22  7.72,15.18 0 bottom
USBCR  23.05,4.83 90 top
USBCR1  31.56,8.19 0 top
USBCR2  36.25,14.38 180 top
USBCR3  36.25,16.16 0 top
USBCR4  40.29,11.87 180 top
USBCR5  11.29,17.08 0 top
USBCR6  39.05,4.1 180 top
USBCR7  39.05,5.14 0 top
USBCR8  35.97,5.11 180 top
USBCR9  41.72,20.16 90 top
USBCR10  41.72,18.1 90 top
USBCR11  18.44,17.08 0 top
USBCR12  15.84,17.08 180 top
USBCR13  23.87,8.11 0 top
USBCR14  2.25,2.41 180 top
USBCR15  2.25,1.39 180 top
USBCR17  35.21,22.73 90 top
USBCR18  35.17,18.76 270 top
USBCR19  48.95,9.47 90 top
X1  53.75,12.64 90 top
X2  25.75,20.29 0 top
X3  10.57,20.29 0 top
X4  53.75,4.92 90 top

### Tracks (layer width: path | path; a pad name or v marks a point on that pad's centre or on a via)
3V3  (via drill 0.35)
  Top 0.254: U5.44 32.52,13.89 33.21,13.21 34.54,13.21 34.87,13.54 34.87,15.75 34.16,16.46 34.16,17.08 | 1.94,6.57 3.65,6.57 3.65,5.61 3.51,5.47 IC2.2 2.7,5.46 2.06,4.82 1.94,4.82 | 1.94,6.57 2.19,6.82 C2.1 | 1.94,6.57 IC2.8 | IC2.6 1.94,4.82 | 1.94,4.82 2.06,4.7 2.06,3.02 1.79,2.76 USBCR14.2 USBCR15.2 | U5.17 22.86,13.89 C3.1 22.86,14.1 21.93,15.02 21.93,16.89 20.64,18.19 18.02,18.19 17.99,18.16 | U5.36 30.78,8.86 31.14,8.86 v31.3,9.02 | IC3.10 41,20.24 41.02,20.22 v40.92,20.22 | 37.56,17.08 37.44,16.97 v37.44,16.3 | USBCR12.1 USBCR11.1 | 28.65,18.52 28.64,18.52 28.64,17.41 28.28,17.05 U5.6 | USBCR15.2
  Top 0.406: C4.1 C2.1
  Top 0.508: C4.1 5.63,7.43 U2.13
  Top 0.61: U2.13 16.94,7.19 17.99,8.25 USBCR11.1 17.99,18.16 17.99,22.44 18.24,22.69 25.39,22.69 27.01,21.06 X2.4 27.01,20.15 28.65,18.52 28.88,18.29 31.81,18.29 33.02,17.08 34.16,17.08 37.56,17.08 39.59,17.08 40.19,16.48 42.03,16.48 | 42.03,16.48 C11.1 | 42.03,16.48 v42.83,16.48 43.4,16.48 43.88,16 U4.5
  Bottom 0.254: v40.92,20.22 42.33,18.82 42.33,16.82 42.67,16.48 v42.83,16.48 | v31.3,9.02 31.3,9.79 32.23,10.72 35.43,10.72 37.11,12.4 37.11,16.03 37.38,16.3 v37.44,16.3
ANT  (via drill 0.35)
  Top 0.254: 3.77,14.28 2.1,14.28 J1.1 | v6.98,15.16 5.9,15.16 U2.9
  Top 0.813: U2.9 4.68,15.19 3.77,14.28
  Bottom 0.254: U$22.P$2 7.46,15.16 v6.98,15.16
BATT+  (via drill 0.35)
  Top 0.254: IC1.7 38.68,7.67 38.37,7.98 v38.37,8.7 | U4.3 45.62,12.89 v45.62,11.87 | 43.92,12.02 40.82,12.02 40.74,11.94 USBCR4.1 40.47,12.14 40.47,14.71 40.41,14.76 Q2.8 40.08,15.57 Q2.4 | IC4.2 IC4.1 48,12.9 48,12.75 | IC4.4 49.32,12.65 49.49,12.48 49.49,11.43 USBCR19.2 | IC4.2 48,12.75 | 48,12.75 48,12.54 | IC4.2 48.32,12.55 48,12.22
  Top 0.61: U4.1 43.88,12.06 43.92,12.02 44.44,11.5 C7.1
  Top 0.813: 48,12.54 48,12.22 48,11.47 48.57,10.89 USBCR19.2 | X1.1 53.27,10.89 USBCR19.2 | USBCR19.2 48.84,11.01 C7.1 | USBCR19.2 45.59,10.89 45.62,10.92 v45.62,11.87
  Bottom 0.254: v38.37,8.7 38.37,9.16 41.08,11.87 v45.62,11.87
BATT_SW
  Top 0.254: IC4.8 IC4.7 | IC4.8 48.11,15.47 | 48.11,15.47 48.11,15.76 | IC4.7 48.32,15.55 | IC4.7 48.11,15.39 48.11,15.47 | C14.2 48.19,16.42 48.43,16.65 48.49,16.65 | C14.2 48.74,16.41 | C14.2 47.82,15.95 IC4.8
  Top 0.508: 48.74,16.41 48.49,16.65 46.48,18.67 U1.5
  Top 0.813: L3.1 54.77,18.96 53.15,17.34 49.72,17.34 48.47,16.09 48.44,16.09 48.11,15.76 48.11,15.72
D3  (via drill 0.35)
  Top 0.254: U5.14 23.91,15.39 23.78,15.53 v23.49,15.53
  Bottom 0.254: U$10.P$2 21.55,14.64 22.44,15.53 v23.49,15.53
D6  (via drill 0.35)
  Top 0.254: U5.29 27.28,8.91 v27.29,8.89
  Bottom 0.254: v27.29,8.89 26.61,9.58 25.66,9.58 24.59,10.65 24.59,13.07 23.79,13.87 21.41,11.5 U$11.P$2
D7  (via drill 0.35)
  Top 0.254: U5.30 27.78,9.12 27.8,9.1 27.8,8.53 27.46,8.2 27.27,8.2 v27.25,8.22
  Bottom 0.254: v27.25,8.22 27.34,8.3 27.53,8.3 27.89,8.66 27.89,9.07 26.98,9.98 25.86,9.98 24.99,10.84 24.99,13.57 24.3,14.26 23.63,14.26 22.26,12.9 U$7.P$2
D9  (via drill 0.35)
  Top 0.254: U5.12 24.25,16.58 v23.76,17.07 | v12.4,16.85 | X3.3 12.4,19.73 v12.4,16.85
  Bottom 0.254: v23.76,17.07 23.68,17.15 20.6,17.15 20.34,16.89 12.44,16.89 v12.4,16.85
DAVIS_DIR  (via drill 0.35)
  Top 0.254: U5.10 26.28,17.05 26.06,17.28 25.55,17.28 v25.36,17.47 | v20.07,17.39 19.2,17.39 USBCR11.2
  Bottom 0.254: v25.36,17.47 25.25,17.57 20.16,17.57 20.07,17.48 v20.07,17.39 20.04,17.36 9.36,17.36 U$3.P$1
DAVIS_SPEED  (via drill 0.35)
  Top 0.254: U5.9 26.78,17.13 26.69,17.22 v26.03,17.88 | C15.2 14.11,17.04 15.35,17.04 USBCR12.2 14.93,17.08 14.92,17.07 14.83,17.15 v14.83,17.9
  Bottom 0.254: v26.03,17.88 25.95,17.96 15.24,17.96 14.9,17.96 v14.83,17.9 14.79,17.94 8.82,17.94 U$1.P$1
EN_HEATER  (via drill 0.35)
  Top 0.254: v32.92,15.68 32.63,15.39 U5.47 | U1.4 45.23,17.08 40.41,17.08 39.78,17.72 34.22,17.72 33.9,18.03 v33.78,17.91
  Bottom 0.254: v33.78,17.91 33.78,17.53 32.92,16.67 v32.92,15.68
FB
  Top 0.152: USBCR10.1 41.66,17.65
  Top 0.254: 40.57,18.74 40.96,18.74 41.3,19.08 41.31,19.08 41.72,19.49 USBCR9.1 | USBCR10.1 43.46,17.65 U1.3 | IC3.7 40.57,18.74 | 41.66,17.65 40.57,18.74
FB_R  (via drill 0.35)
  Top 0.152: v35.97,22.29 USBCR17.1
  Top 0.254: v40.85,19.45 40.82,19.45 40.62,19.25 39.98,19.25 IC3.8
  Bottom 0.254: v35.97,22.29 37.76,22.29 40.59,19.45 v40.85,19.45
GND  (via drill 0.35)
  Top 0.152: 36.1,18.7 36.94,18.7 IC3.4
  Top 0.254: U5.42 29.62,12.89 | 29.62,12.89 28.67,12.89 | 28.67,12.89 28.28,12.89 U5.49 | U5.35 30.28,12.23 29.62,12.89 | U5.18 28.17,13.39 28.29,13.27 | 28.29,13.27 28.67,12.89 | U5.5 28.78,13.77 28.29,13.27 | USBCR7.2 40.32,5.14 v40.32,5.3 | v36.41,9.65 35.52,9.65 35.51,9.67 IC1.2 33.6,9.67 33.53,9.74 33.53,11.54 33.62,11.62 C5.2 | IC2.7 2.03,5.47 2.69,6.12 IC2.1 | 43.4,18.8 U1.2 | USBCR10.2 41.84,18.67 | USBCR18.1 35.3,19.21 35.81,18.7 36.1,18.7 | 3.68,8.48 C4.2
  Top 0.61: J2.GND2 33.15,5.18 J2.SHLD2 | J2.GND 24.87,5.18 J2.SHLD3
  other vias: 37.81,10.66 16.95,20.17 37.33,5.21 52.03,1.78 32.41,7.36 19.05,0.85 30.32,4.56 36.83,6.44 39.91,1.01 50.67,8.12 46.38,14.37 43.76,22.17 46.35,20.56 43.8,3.97 36.92,1.42 19.05,3.04 55.3,17.62 40.83,15.49 20.7,21.56 29.33,22.67 19.65,8.18 43.66,0.73 36.1,23.11 39.02,11.72 11.37,11.14 9.47,14.98 5.02,19.01 4.24,12.74 4.24,15.98 13.12,19.2 19.14,6.72 21.3,16.5 44.8,16.31 48.07,22.63 54.1,1.01 42.57,9.64 47.64,5.4 4.85,23.01 38.25,16.32 33.68,20.35 24.27,6.55 40.54,21.02 33.56,16.32 18.93,12.65 50.8,18.86 35.08,20.13 8.73,10.11 3.83,20.71 0.99,8.56 43.78,14.38 41.49,11.13 47.02,19.61 44.67,20.5 45.56,21.14 42.71,20.78 54.89,22.51 50.35,16.29 50.83,4.92 46.38,16.92 23.43,9.77 22.18,13.78 31.36,16.62 30.38,8.37 39.62,23.08 2.95,8.73 8.62,8.71 11.63,8.71 20.45,10.17 0.83,19.29 3.04,19.33 0.54,9.9 3.33,9.81 9.15,12.1 26.62,8.12 44.71,17.77 44.75,18.72 44.65,19.63 42.47,20.06
  pour Top: -0.48,24.35 -0.48,-1.17 57.24,-1.17 57.24,24.35
  pour Bottom: -1.21,24.99 -1.21,-1.49 57.78,-1.49 57.78,24.99
HEATER
  Top 0.254: USBCR9.2 41.73,20.63 41.73,21.81 D1.C
  Top 0.813: X2.6 33.22,21.42 36.43,21.42 36.54,21.53 C12.2 C9.2 39.09,21.54 39.62,22.07 40.01,22.08 40.6,22.08 D1.C
LED
  Top 0.254: U5.26 25.78,9.16 24.73,8.11 USBCR13.2
MPPT  (via drill 0.35)
  Top 0.254: USBCR6.2 USBCR7.1 38.6,6.55 38.71,6.67 IC1.6 38.74,6.67 v38.36,7.05 | IC3.6 40.49,18.24 40.76,17.97 v40.76,17.72
  Bottom 0.254: v40.76,17.72 40.7,17.72 37.96,14.98 37.96,11.77 37.09,10.9 37.09,8.32 v38.36,7.05
MPPT_R
  Top 0.254: IC3.5 35.25,18.24 USBCR18.2
N$1  (via drill 0.35)
  Top 0.254: IC1.10 41.08,10.67 41.4,10.35 v41.4,9.97 | v50.61,0.97 50.38,0.75 Q1.3
  Bottom 0.254: v41.4,9.97 42.35,9.02 42.35,3.52 44.96,0.91 50.5,0.91 50.56,0.97 v50.61,0.97
N$2
  Top 0.254: D2.C 45.67,1.71 45.8,1.84
  Top 0.406: Q1.6 Q1.5 48.19,2.33 Q1.7 48.19,1.03 Q1.2 Q1.1
  Top 0.813: L1.1 46.17,2.21 45.8,1.84 | D2.C 48.16,1.71 Q1.7
N$3
  Top 0.254: 42.6,7.51 41.45,8.67 IC1.8
  Top 0.813: 42.6,7.51 42.47,7.5 L1.2 42.47,6.87 44.89,9.29 47.33,9.29 48.57,8.05 USBCR19.1
N$4
  Bottom 0.254: X3.1 6.99,20.29 7.94,19.34 7.94,17.98 8.01,17.91 U$1.P$2 U$2.P$1
N$5  (via drill 0.35)
  Top 0.254: USBCR13.1 23.42,8.05 v22.89,7.52 | v22.95,3.52 23.01,3.46 LED1.A
  Bottom 0.254: v22.89,7.52 22.82,7.52 22.8,7.5 22.8,3.68 v22.95,3.52
N$6
  Top 0.254: Q2.2 Q2.1 38.65,14.49 38.67,14.51 | Q2.7 38.76,14.51 38.67,14.51 | USBCR2.1 38.44,14.38 38.57,14.51 | 38.57,14.51 38.67,14.51 | Q2.5 Q2.6 38.65,14.59 38.57,14.51
N$7
  Top 0.254: IC1.1 34.73,10.76 34.73,11.08 C10.1
N$8  (via drill 0.35)
  Top 0.254: X3.2 9.31,18.74 v7.91,17.34
  Bottom 0.254: U$4.P$1 7.79,16.8 | 7.79,16.8 U$3.P$2 | 7.79,16.8 7.79,17.22 v7.91,17.34
N$9
  Bottom 0.254: U$22.P$1 8.1,15.17 10.77,12.49 J4.1
N$10
  Top 0.254: C1.1 36.5,5.19 36.45,5.09 USBCR8.1
N$11
  Top 0.254: USBCR8.2 35.52,6.6 35.49,6.57 35.4,6.67 IC1.5
N$12
  Top 0.254: USBCR4.2 39.96,12 39.96,13.82 Q2.3 39.95,13.27 C6.1
N$17
  Top 0.254: J2.A5 27.76,5.11 26.46,3.8 24.19,3.8 23.62,4.38 USBCR.1
N$18
  Top 0.254: USBCR1.1 30.76,7.85 J2.B5
PV_CHARGE
  Top 0.254: U5.38 32.18,10.9 32.35,10.73 32.35,9.46 33.14,8.67 IC1.3
PV_DONE
  Top 0.254: IC1.4 33.54,7.67 31.94,9.27 31.94,10.3 31.85,10.39 U5.37
PV_IN+  (via drill 0.35)
  Top 0.254: 38.06,5.53 38.06,6.48 37.72,6.82 37.72,9.13 38.26,9.67 IC1.9 38.44,9.67 38.44,11.19 37.63,12 C10.2 | 38.06,5.53 | 38.06,5.53 38.06,3.62 38.19,3.49 39.5,3.49 USBCR6.1 39.5,3.52 39.71,3.31 44.08,3.31 v44.5,3.74
  Top 0.406: 49.3,2.79 Q1.4 49.25,2.49 Q1.8
  Top 0.61: C13.1 48.32,4.67 C8.1 49.65,2.93
  Top 0.813: X4.1 51.68,3.65 50.82,2.79 49.3,2.79 49.44,2.93 49.65,2.93
  Bottom 0.254: X4.1 52.67,2.57 45.66,2.57 v44.5,3.74
PW_SW  (via drill 0.35)
  Top 0.254: U5.13 23.99,15.89 23.17,16.71 23.17,18.38 v23.49,18.7 | v11.7,18.47 11.74,18.43 USBCR5.2 | IC4.3 48.82,12.29 v48.86,12.26 | v38.92,12.64 38.84,12.71 34.72,12.71 34.6,12.59 v34.44,12.59
  Bottom 0.254: v11.7,18.47 11.8,18.56 23.23,18.56 23.36,18.7 v23.49,18.7 23.72,18.47 26.26,18.47 26.61,18.12 26.61,12.88 27.03,12.46 34.32,12.46 v34.44,12.59 | v48.86,12.26 48.13,12.99 39.27,12.99 v38.92,12.64
RESET  (via drill 0.35)
  Top 0.254: U5.40 32.04,11.89 32.95,10.99 v32.95,9.72 | SW1.1 SW1.3 34.72,2.51 34.16,3.08 v34.16,3.87
  Bottom 0.254: v32.95,9.72 32.95,8.54 34.83,6.67 34.83,4.7 34.16,4.03 v34.16,3.87
RFM_CS
  Top 0.254: U5.24 24.02,10.39 23.99,10.36 23.17,10.36 22,9.19 U2.5
RFM_DIO0
  Top 0.254: U2.14 6.18,4.87 17.69,4.87 18.81,6 21.4,6 22.03,6.63 22.03,7.68 23.39,9.04 25.12,9.04 25.28,9.2 U5.25
RFM_DIO1
  Top 0.254: U5.27 26.28,9.07 24.74,7.52 23.74,7.52 22.03,5.81 22.03,4.66 21.76,4.39 8.94,4.39 7.74,3.19 U2.15
RFM_DIO2
  Top 0.254: U5.28 26.78,9.01 24.85,7.09 23.88,7.09 22.44,5.64 22.44,4.49 22.03,4.08 22.03,2.66 21.76,2.39 21.75,2.39 21.59,2.22 8.49,2.22 7.45,1.19 U2.16
RFM_MISO  (via drill 0.35)
  Top 0.254: U5.21 24.08,11.89 23.69,11.5 v23.69,11.4 | U2.2 19.82,3.19 v19.24,3.78
  Bottom 0.254: v23.69,11.4 23.27,11.4 20.89,9.02 20.89,5.68 19.24,4.03 v19.24,3.78
RFM_MOSI  (via drill 0.35)
  Top 0.254: U5.19 23.65,12.89 v23.62,12.92 | U2.3 20.65,5.21 v19.11,5.21
  Bottom 0.254: v23.62,12.92 23.62,12.35 20.47,9.21 20.47,5.91 19.78,5.21 v19.11,5.21
RFM_RESET
  Top 0.254: U5.23 23.9,10.89 23.8,10.8 21.06,10.8 U2.6
RFM_SCK
  Top 0.254: U5.20 23.92,12.39 23.54,12.01 19.53,12.01 18.86,11.33 18.86,7.89 19.56,7.19 U2.4
RX
  Top 0.254: U5.16 23.17,14.39 22.36,15.2 22.36,17.04 19.39,20.01 X2.1
RX1  (via drill 0.35)
  Top 0.254: v30.31,17.51 30.28,17.48 U5.2
  Bottom 0.254: U$13.P$3 28.06,15.62 29.91,17.47 30.27,17.47 v30.31,17.51
SCL  (via drill 0.35)
  Top 0.254: U5.32 28.78,7.87 v28.72,7.81 | IC3.2 36.43,19.73 v36.04,20.13 | USBCR15.1 3.41,1.39 v3.43,1.41 3.55,1.41 4,1.85 4,2.47 3.08,3.39 IC2.4
  Bottom 0.254: v36.04,20.13 36.16,20.13 36.69,19.59 36.69,12.56 35.26,11.13 31.98,11.13 28.72,7.86 v28.72,7.81 28.66,7.81 28,7.15 25.99,7.15 25.08,8.07 22.57,8.07 22.37,7.87 22.37,3.13 21.28,2.04 4.19,2.04 3.55,1.41 v3.43,1.41 2.86,1.41 2.69,1.58 2.69,4.06 5.64,7.01 5.64,16.54 U$2.P$2
SDA  (via drill 0.35)
  Top 0.254: U5.31 28.28,8.21 v27.87,7.8 v27.86,7.8 | IC2.3 3.06,4.79 2.69,4.79 2.54,4.64 2.54,2.57 USBCR14.1 2.91,2.2 v3.42,2.2 | v36,19.34 36.1,19.24 IC3.3
  Bottom 0.254: v36,19.34 36.1,19.34 36.29,19.15 36.29,12.73 35.09,11.53 31.72,11.53 28.03,7.84 27.9,7.84 v27.86,7.8 27.86,7.78 27.65,7.57 26.13,7.57 25.22,8.48 22.35,8.48 21.97,8.1 21.97,3.3 21.11,2.45 3.67,2.45 v3.42,2.2 3.14,2.47 3.14,3.9 6.06,6.82 6.06,15.86 6.46,16.26 6.48,16.26 U$4.P$2
SW
  Top 0.508: U1.1 43.53,20.58 45.13,22.18 D1.A
  Top 0.813: D1.A 46.15,22.51 L3.2
SWDCLK
  Top 0.254: PH1.1 33.7,14.39 U5.45
SWDIO
  Top 0.254: PH1.2 33.46,14.89 U5.46
TX
  Top 0.254: U5.15 23.26,14.89 22.77,15.39 22.77,19.46 X2.2
TX1  (via drill 0.35)
  Top 0.254: v31.4,17.46 31.24,17.46 30.78,17.01 U5.1
  Bottom 0.254: U$13.P$1 30.76,14.45 30.76,16.99 31.24,17.46 v31.4,17.46
USB_N
  Top 0.254: U5.33 29.28,7.27 29.28,7.11 | 29.28,7.11 29.28,6.11 J2.A7 | J2.B7 28.26,6.97 28.41,7.11 29.28,7.11
USB_P
  Top 0.254: U5.34 29.78,6.11 J2.B6 29.76,5.1 29.62,4.95 28.86,4.95 28.76,5.04 J2.A6
V_DIV  (via drill 0.35)
  Top 0.254: v28.06,17.65 27.78,17.37 U5.7 | USBCR2.2 35.8,16.32 35.55,16.32 | v35.05,16.32 35.55,16.32 | USBCR3.1 35.71,16.16 35.55,16.32
  Bottom 0.254: v28.06,17.65 28.48,18.07 33.11,18.07 33.54,18.49 34.02,18.49 35.44,17.07 35.44,16.71 v35.05,16.32
V_IMP  (via drill 0.35)
  Top 0.254: v27.73,18.22 27.28,17.77 U5.8 | C6.2 35.49,13.27 v35.46,13.3
  Bottom 0.254: v27.73,18.22 27.94,18.22 28.19,18.48 32.95,18.48 33.4,18.92 34.16,18.92 35.88,17.2 35.88,13.72 v35.46,13.3
V_USB  (1 unrouted)
VDDCORE
  Top 0.254: U5.43 32.44,13.39 33.04,12.8 33.39,12.8 C5.1

### Text on the board
tNames: RFM95W / G-NiceRF 1262 | JLCJLCJLCJLC
bNames: + | Dir. | Speed | GND | V1.4 | RX | TX | GND | 3V3 | GND | Heater | SCL | SDA | ID2 | swdio | swdclk | GND | ID1 | RX1 | TX1 | ID0 | Batt+ | GND | Solar | SN: | BreezeDude